# EAGLE design mrShark 07 (EAGLE 6.1)

## Sheet 1 of 2
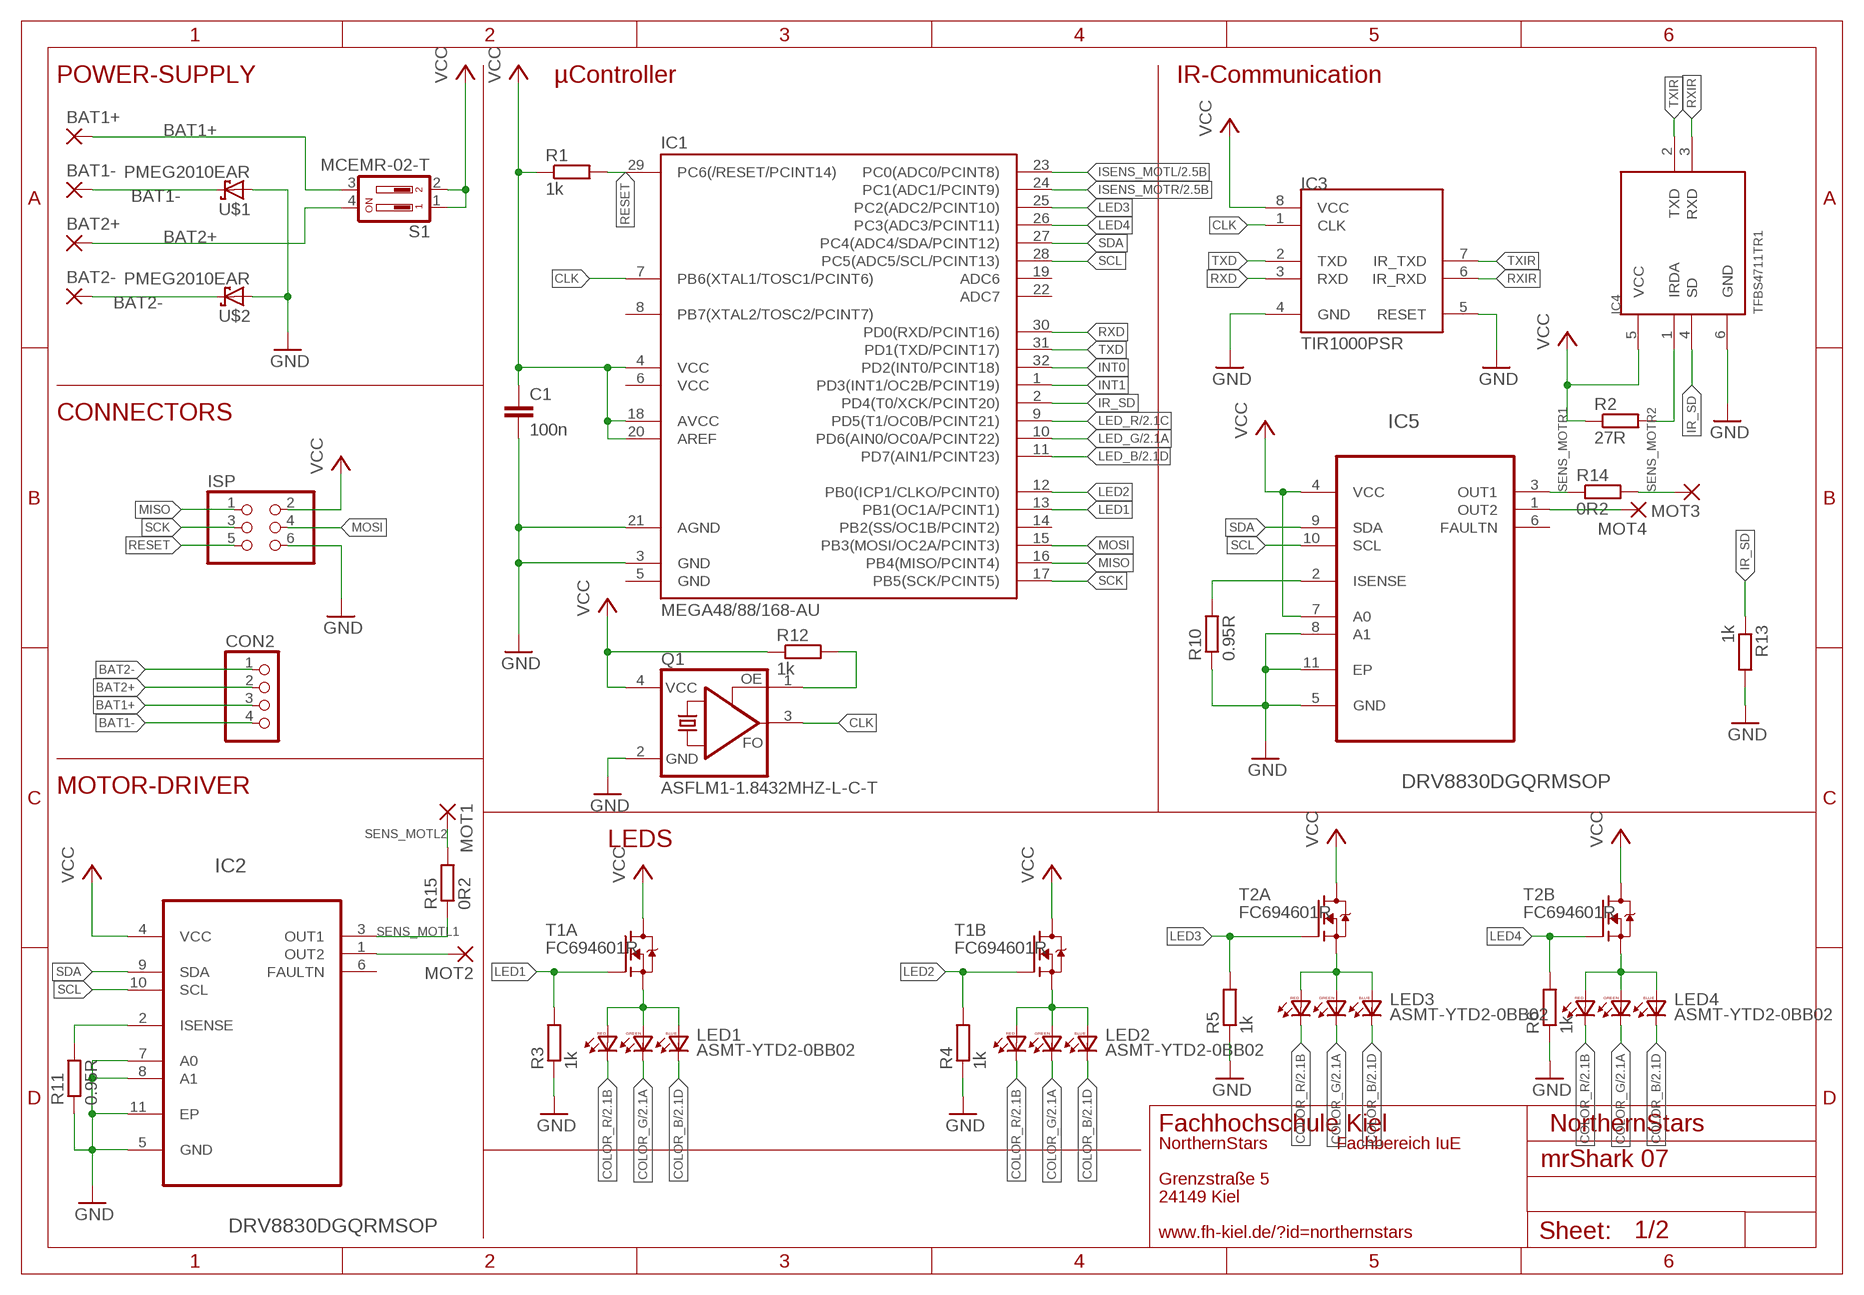
[diagram p0: schematic, sheet 1]

### Parts
BAT1+  1,6/0,9  [1,6/0,9]
BAT1-  1,6/0,9  [1,6/0,9]
BAT2+  1,6/0,9  [1,6/0,9]
BAT2-  1,6/0,9  [1,6/0,9]
C1  100n  C-EUC1206  [C1206]
CON2  PINHD-1X04_2.54-SMD-90°  [1X04SMD/90]
IC1  MEGA48/88/168-AU  [TQFP32-08]
IC2  DRV8830DGQRMSOP  [SOP65P640X110-15N]
IC3  TIR1000PSR  [SO-08]
IC4  TFBS4711TR1  [TFBS4711]
IC5  DRV8830DGQRMSOP  [SOP65P640X110-15N]
ISP  PINHD-2X03_2.54-SMD  [2X03SMD]
LED1  ASMT-YTD2-0BB02  PLCC6K  [PLCC6K]
LED2  ASMT-YTD2-0BB02  PLCC6K  [PLCC6K]
LED3  ASMT-YTD2-0BB02  PLCC6K  [PLCC6K]
LED4  ASMT-YTD2-0BB02  PLCC6K  [PLCC6K]
MOT1  1,6/0,9  [1,6/0,9]
MOT2  1,6/0,9  [1,6/0,9]
MOT3  1,6/0,9  [1,6/0,9]
MOT4  1,6/0,9  [1,6/0,9]
Q1  ASFLM1-1.8432MHZ-L-C-T  HC536R  [HC536]
R1  1k  R-EU_R1206  [R1206]
R2  27R  R-EU_R1206  [R1206]
R3  1k  R-EU_R1206  [R1206]
R4  1k  R-EU_R1206  [R1206]
R5  1k  R-EU_R1206  [R1206]
R6  1k  R-EU_R1206  [R1206]
R10  0.95R  R-EU_R1206  [R1206]
R11  0.95R  R-EU_R1206  [R1206]
R12  1k  R-EU_R1206  [R1206]
R13  1k  R-EU_R1206  [R1206]
R14  0R2  R-EU_R0805  [R0805]
R15  0R2  R-EU_R0805  [R0805]
S1  MCEMR-02-T  219-02  [CTS-219-02]
T1  FC694601R  [SOT-666]
T2  FC694601R  [SOT-666]
U$1  PMEG2010EAR  [SOD323-R]
U$2  PMEG2010EAR  [SOD323-R]

### Nets
BAT1+: BAT1+.1(P) CON2.3 S1.3
BAT1-: BAT1-.1(P) CON2.4 U$1.C
BAT2+: BAT2+.1(P) CON2.2 S1.4
BAT2-: BAT2-.1(P) CON2.1 U$2.C
CLK: IC1.7(PB6(XTAL1/TOSC1/PCINT6)) IC3.1(CLK) Q1.3(FO)
COLOR_B: LED1.1(BC) LED2.1(BC) LED3.1(BC) LED4.1(BC) ; also sheet 2
COLOR_G: LED1.2(GC) LED2.2(GC) LED3.2(GC) LED4.2(GC) ; also sheet 2
COLOR_R: LED1.3(RC) LED2.3(RC) LED3.3(RC) LED4.3(RC) ; also sheet 2
GND: C1.2 IC1.3(GND) IC1.21(AGND) IC2.5(GND) IC2.7(A0) IC2.8(A1) IC2.11(EP) IC3.4(GND) IC3.5(RESET) IC4.6(GND) IC5.5(GND) IC5.8(A1) IC5.11(EP) ISP.6 Q1.2(GND) R3.1 R4.1 R5.1 R6.1 R10.1 R11.1 R13.2 U$1.A U$2.A ; also sheet 2
INT0: IC1.32(PD2(INT0/PCINT18))
INT1: IC1.1(PD3(INT1/OC2B/PCINT19))
IR_SD: IC1.2(PD4(T0/XCK/PCINT20)) IC4.4(SD) R13.1
IRDA: IC4.1(IRDA) R2.2
ISENS_MOTL: IC1.23(PC0(ADC0/PCINT8)) ; also sheet 2
ISENS_MOTR: IC1.24(PC1(ADC1/PCINT9)) ; also sheet 2
LED1: IC1.13(PB1(OC1A/PCINT1)) R3.2 T1.2(A:G)
LED1+: LED1.4(RA) LED1.5(GA) LED1.6(BA) T1.1(A:S)
LED2: IC1.12(PB0(ICP1/CLKO/PCINT0)) R4.2 T1.5(B:G)
LED2+: LED2.4(RA) LED2.5(GA) LED2.6(BA) T1.4(B:S)
LED3: IC1.25(PC2(ADC2/PCINT10)) R5.2 T2.2(A:G)
LED3+: LED3.4(RA) LED3.5(GA) LED3.6(BA) T2.1(A:S)
LED4: IC1.26(PC3(ADC3/PCINT11)) R6.2 T2.5(B:G)
LED4+: LED4.4(RA) LED4.5(GA) LED4.6(BA) T2.4(B:S)
LED_B: IC1.11(PD7(AIN1/PCINT23)) ; also sheet 2
LED_G: IC1.10(PD6(AIN0/OC0A/PCINT22)) ; also sheet 2
LED_R: IC1.9(PD5(T1/OC0B/PCINT21)) ; also sheet 2
MISO: IC1.16(PB4(MISO/PCINT4)) ISP.1
MOSI: IC1.15(PB3(MOSI/OC2A/PCINT3)) ISP.4
N$3: IC5.1(OUT2) MOT4.1(P)
N$4: Q1.1(OE) R12.2
N$5: IC5.2(ISENSE) R10.2
N$7: IC2.2(ISENSE) R11.2
N$16: IC2.1(OUT2) MOT2.1(P)
RESET: IC1.29(PC6(/RESET/PCINT14)) ISP.5 R1.2
RXD: IC1.30(PD0(RXD/PCINT16)) IC3.3(RXD)
RXIR: IC3.6(IR_RXD) IC4.3(RXD)
SCK: IC1.17(PB5(SCK/PCINT5)) ISP.3
SCL: IC1.28(PC5(ADC5/SCL/PCINT13)) IC2.10(SCL) IC5.10(SCL)
SDA: IC1.27(PC4(ADC4/SDA/PCINT12)) IC2.9(SDA) IC5.9(SDA)
SENS_MOTL1: IC2.3(OUT1) R15.1 ; also sheet 2
SENS_MOTL2: MOT1.1(P) R15.2 ; also sheet 2
SENS_MOTR1: IC5.3(OUT1) R14.1 ; also sheet 2
SENS_MOTR2: MOT3.1(P) R14.2 ; also sheet 2
TXD: IC1.31(PD1(TXD/PCINT17)) IC3.2(TXD)
TXIR: IC3.7(IR_TXD) IC4.2(TXD)
VCC: C1.1 IC1.4(VCC) IC1.18(AVCC) IC1.20(AREF) IC2.4(VCC) IC3.8(VCC) IC4.5(VCC) IC5.4(VCC) IC5.7(A0) ISP.2 Q1.4(VCC) R1.1 R2.1 R12.1 S1.1 S1.2 T1.3(B:D) T1.6(A:D) T2.3(B:D) T2.6(A:D) ; also sheet 2
Unconnected: IC1.8(PB7(XTAL2/TOSC2/PCINT7)) IC1.14(PB2(SS/OC1B/PCINT2)) IC1.19(ADC6) IC1.22(ADC7) IC2.6(FAULTN) IC5.6(FAULTN)

### Notes on the sheet
- POWER-SUPPLY | µController | IR-Communication
- CONNECTORS
- MOTOR-DRIVER
- LEDS
- Fachhochschule Kiel | NorthernStars
- NorthernStars | Fachbereich IuE
- Grenzstraße 5
- 24149 Kiel
- www.fh-kiel.de/?id=northernstars

## Sheet 2 of 2
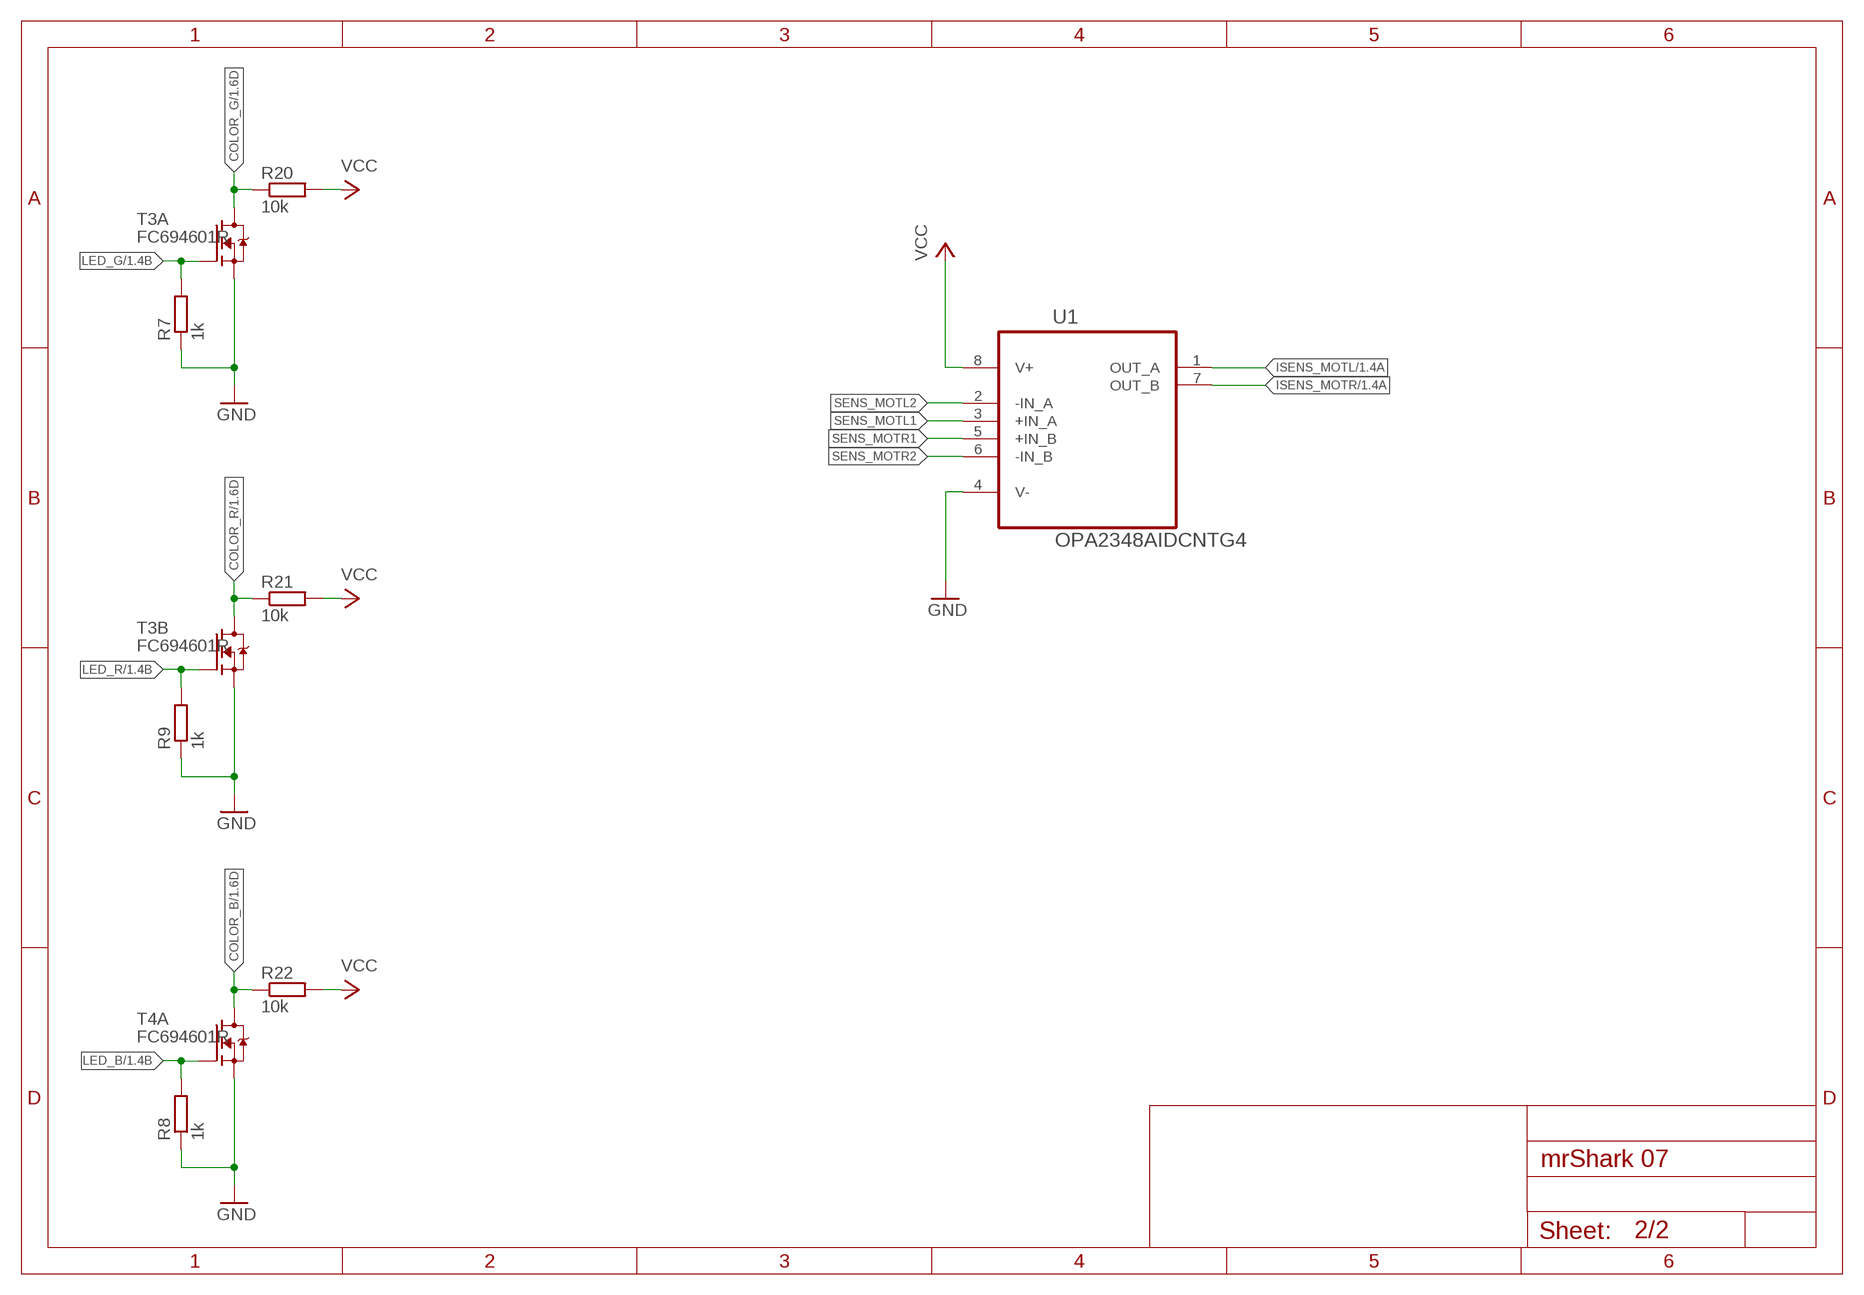
[diagram p1: schematic, sheet 2]

### Parts
R7  1k  R-EU_R1206  [R1206]
R8  1k  R-EU_R1206  [R1206]
R9  1k  R-EU_R1206  [R1206]
R20  10k  R-EU_M0805  [M0805]
R21  10k  R-EU_M0805  [M0805]
R22  10k  R-EU_M0805  [M0805]
T3  FC694601R  [SOT-666]
T4  FC694601R  [SOT-666]
U1  OPA2348AIDCNTG4  [SOT65P280X145-8N]

### Nets
COLOR_B: R22.1 T4.6(A:D) ; also sheet 1
COLOR_G: R20.1 T3.6(A:D) ; also sheet 1
COLOR_R: R21.1 T3.3(B:D) ; also sheet 1
GND: R7.1 R8.1 R9.1 T3.1(A:S) T3.4(B:S) T4.1(A:S) U1.4(V-) ; also sheet 1
ISENS_MOTL: U1.1(OUT_A) ; also sheet 1
ISENS_MOTR: U1.7(OUT_B) ; also sheet 1
LED_B: R8.2 T4.2(A:G) ; also sheet 1
LED_G: R7.2 T3.2(A:G) ; also sheet 1
LED_R: R9.2 T3.5(B:G) ; also sheet 1
SENS_MOTL1: U1.3(+IN_A) ; also sheet 1
SENS_MOTL2: U1.2(-IN_A) ; also sheet 1
SENS_MOTR1: U1.5(+IN_B) ; also sheet 1
SENS_MOTR2: U1.6(-IN_B) ; also sheet 1
VCC: R20.2 R21.2 R22.2 U1.8(V+) ; also sheet 1
Unconnected: T4.3(B:D) T4.4(B:S) T4.5(B:G)

## Power pins joined to a net without a drawn wire
GND: IC1.5(GND)
VCC: IC1.6(VCC)

## Library data of the parts
BAT1+ BAT1- BAT2+ BAT2- MOT1-MOT4 = wirepad:1,6/0,9: THROUGH-HOLE PAD
C1 = rcl:C-EU: CAPACITOR, European symbol
CON2 = pinhead-2:PINHD-1X04: PIN HEADER
IC1 = avr-6:MEGA48/88/168
IC2 IC5 = texas:DRV8830DGQR: LOW-VOLTAGE MOTOR DRIVER WITH SERIAL INTERFACE; MPN: DRV8830DGQR; OC_FARNELL: 1863106; OC_NEWARK: 58T1482; PACKAGE: MSOP-10; SUPPLIER: TEXAS INSTRUMENTS
IC3 = texas:TIR1000: Texas Instruments TIR1000 STANDALONE IrDATM ENCODER AND DECODER
IC4 = vishay:TFBS4711: TRANSCEIVER IRDA Vishay TFBS4711-TR1 Infrared Transciever 900nm, 600µA, 1m range
ISP = pinhead-2:PINHD-2X03: PIN HEADER
LED1-LED4 = led:PLCC6: Standart PLCC6 Package RGB LED
Q1 = crystal:HC536: Crystal HC536R For example: Fox Electronics FOX-HC536R
R1-R15 R20-R22 = rcl:R-EU_: RESISTOR, European symbol
S1 = switch-dil:219-02*: Surface Mount DIP Switch Series 219 SMT CTS Electronic Components Sourc: www.ctscorp.com
T1-T4 = panasonic:FC694601R: FC6946010R Dual N-channel MOSFET
U1 = texas:OPA2348AIDCNTG4: OPERATIONAL AMPLIFIERS; MPN: OPA2348AIDCNTG4; OC_FARNELL: 1207098; OC_NEWARK: 97K6805; PACKAGE: SOT23-8; SUPPLIER: Texas Instruments
U$1 U$2 = diode:PMEG2010EA: NXP - Low V F (MEGA) Schottky barrier diode If = 1A, Vr = 20V http://www.farnell.com/datasheets/687996.pdf

## Board
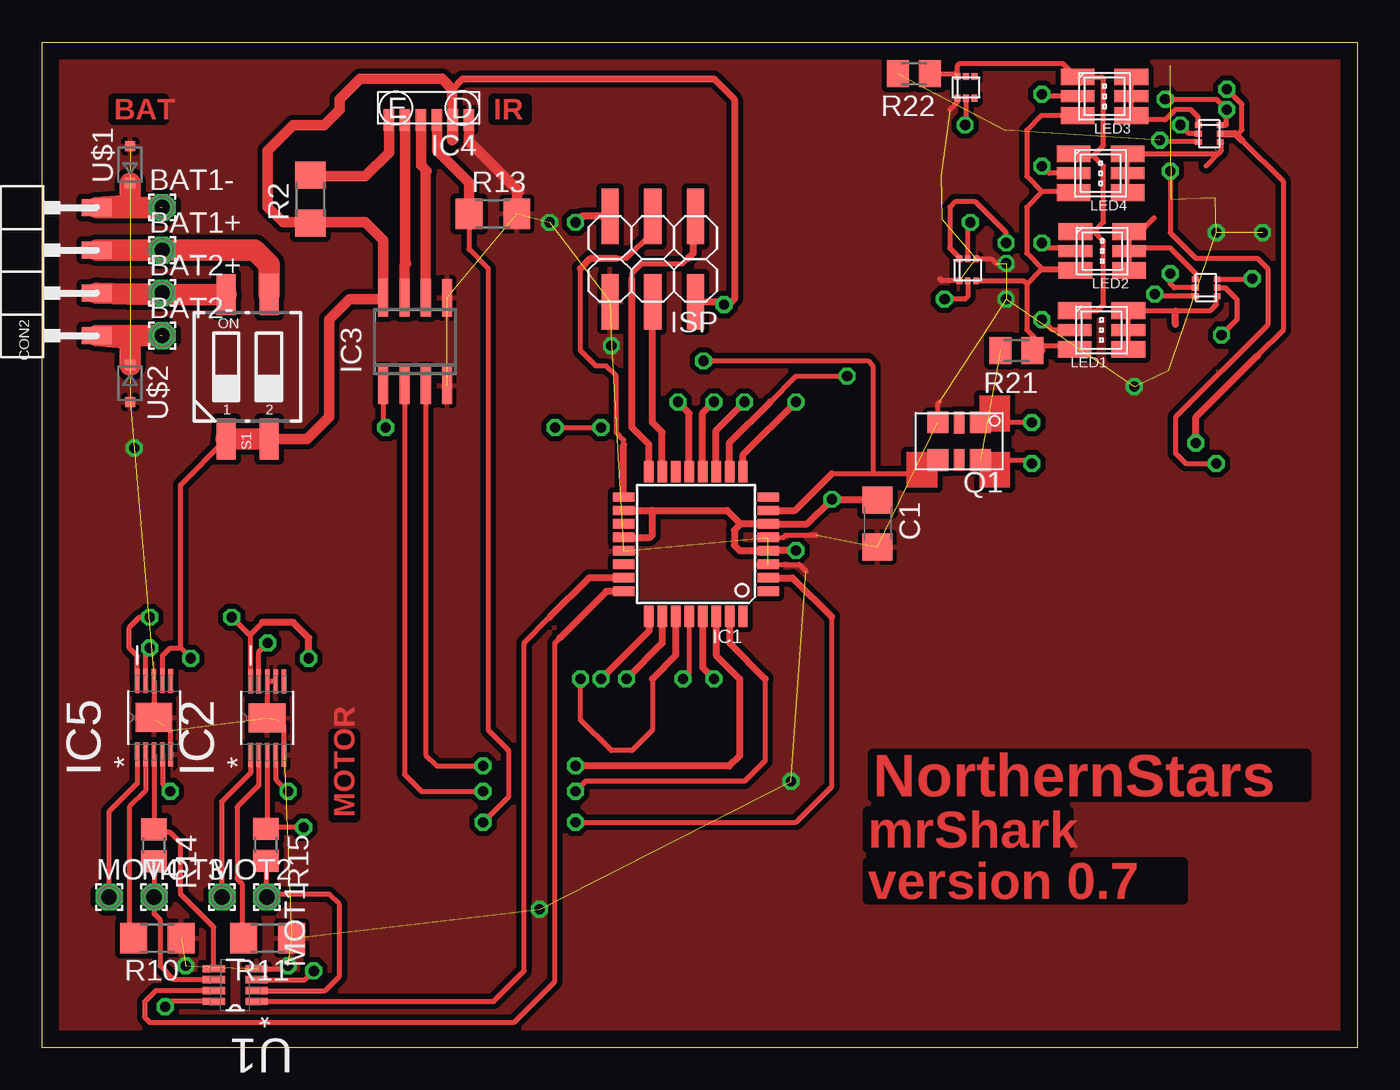
[diagram p2: board, top side]
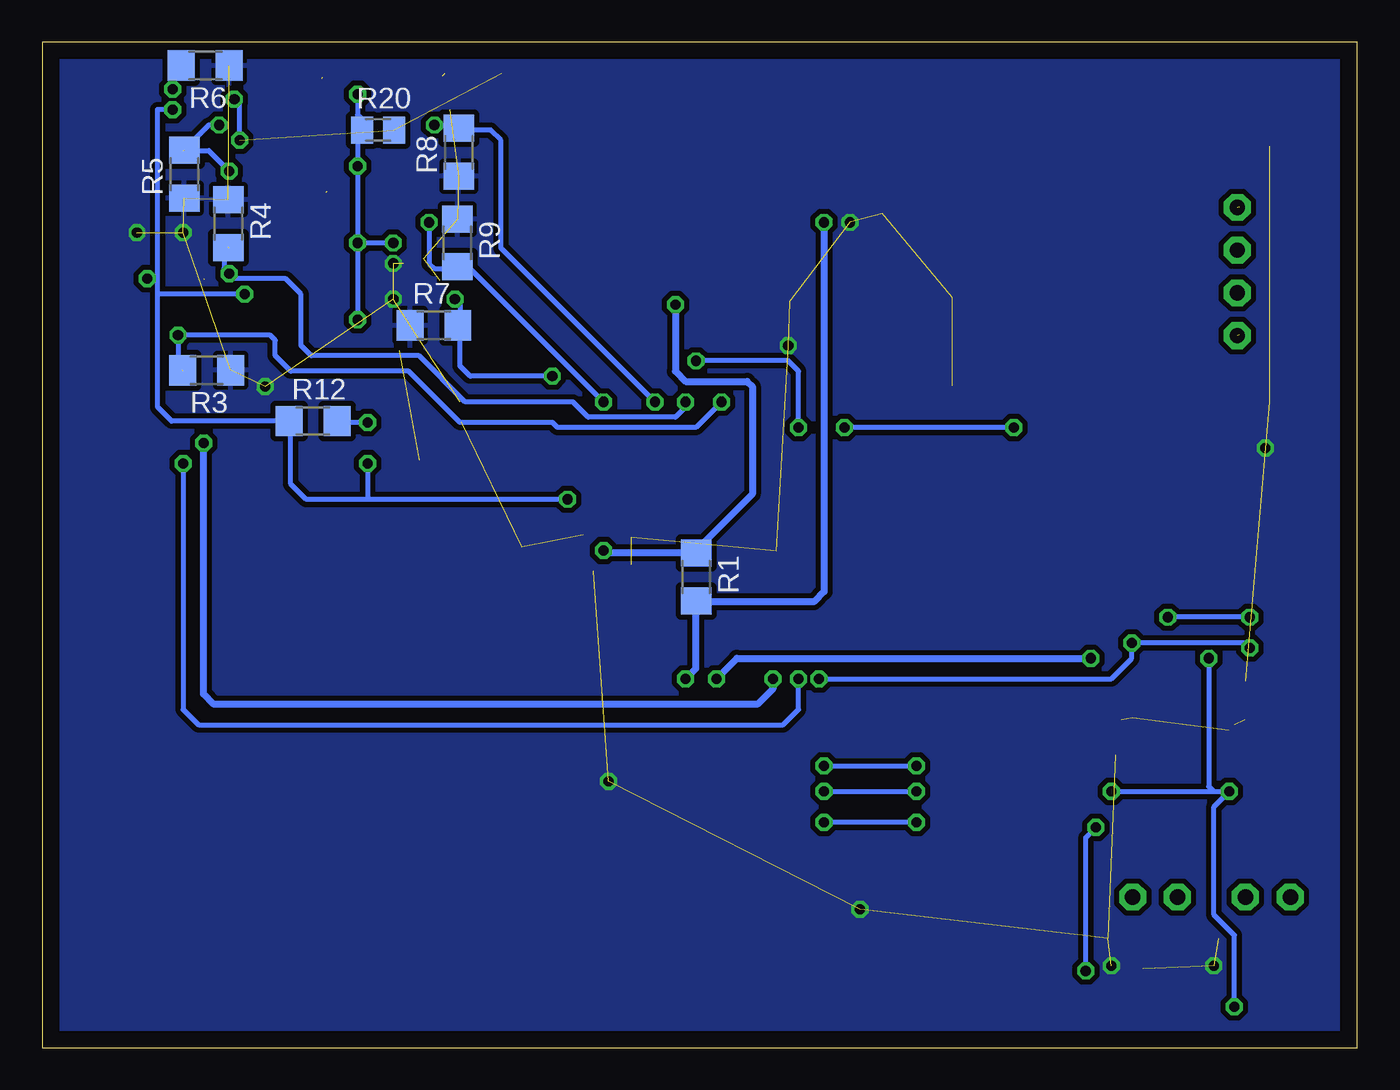
[diagram p3: board, bottom side, seen from below]

Size 78.18 x 59.79 mm. Coordinates in mm from the lower left corner, seen from the top.
Outline: 0,0 0,59.79 78.18,59.79 78.18,0 0,0
Copper layers (1*16): Top 0.035mm / dielectric 1.5mm / Bottom 0.035mm
Design rules: minimum track width 10mil, minimum drill 24mil, track to track 8mil, track to pad 8mil, pad to pad 8mil, via to via 8mil, smd to smd 8mil, copper to edge 40mil, drill to drill 8mil, minimum pad ring 10mil, minimum via ring 8mil, stop-mask expansion 4mil, vias tented up to drill 0mil, thermal gap 10mil
tRestrict: area 52.1,34.4 to 57.3,37.5; area 54.3,56.7 to 55.5,57.6; area 54.3,45.7 to 55.8,46.6

### Footprints (pad centres in the part's own frame; a part is rotated, then mirrored left to right if it is on the bottom)
1,6/0,9 = drill 0.914 pad 1.6 octagon: 1 0,0
C1206 = smd 1.6 x 1.8: 1 -1.4,0; 2 1.4,0
1X04SMD/90 = smd 1.016 x 1.778: 1 -1.27,-5.08; 2 1.27,-5.08; 3 3.81,-5.08; 4 6.35,-5.08
TQFP32-08 = smd 1.27 x 0.559: 1 -4.293,2.8; 2 -4.293,2; 3 -4.293,1.2; 4 -4.293,0.4; 5 -4.293,-0.4; 6 -4.293,-1.2; 7 -4.293,-2; 8 -4.293,-2.8; 17 4.293,-2.8; 18 4.293,-2; 19 4.293,-1.2; 20 4.293,-0.4; 21 4.293,0.4; 22 4.293,1.2; 23 4.293,2; 24 4.293,2.8 | smd 0.559 x 1.27: 9 -2.8,-4.293; 10 -2,-4.293; 11 -1.2,-4.293; 12 -0.4,-4.293; 13 0.4,-4.293; 14 1.2,-4.293; 15 2,-4.293; 16 2.8,-4.293; 25 2.8,4.293; 26 2,4.293; 27 1.2,4.293; 28 0.4,4.293; 29 -0.4,4.293; 30 -1.2,4.293; 31 -2,4.293; 32 -2.8,4.293
SOP65P640X110-15N = smd 1.422 x 0.279: 1 -2.184,0.991; 2 -2.184,0.508; 3 -2.184,0; 4 -2.184,-0.508; 5 -2.184,-0.991; 6 2.184,-0.991; 7 2.184,-0.508; 8 2.184,0; 9 2.184,0.508; 10 2.184,0.991 | smd 1.727 x 2.184: 11 0,0
SO-08 = smd 0.6 x 2.2: 1 -1.905,-2.6; 2 -0.635,-2.6; 3 0.635,-2.6; 4 1.905,-2.6; 5 1.905,2.6; 6 0.635,2.6; 7 -0.635,2.6; 8 -1.905,2.6
TFBS4711 = smd 0.635 x 1.27: 1 2.37,0.72; 2 1.42,0.72; 3 0.47,0.72; 4 -0.48,0.72; 5 -1.43,0.72; 6 -2.38,0.72
2X03SMD = smd 1.016 x 3.302: 1 -1.27,-3.81; 2 -1.27,1.27; 3 1.27,-3.81; 4 1.27,1.27; 5 3.81,-3.81; 6 3.81,1.27
PLCC6K = smd 2 x 1: 1 1.6,-1.15; 3 1.6,1.15; 4 -1.6,1.15; 6 -1.6,-1.15 | smd 2 x 0.7: 2 1.6,0; 5 -1.6,0
HC536 = smd 1.24 x 1.29: 1 -1.27,-1.125; 2 1.27,-1.125; 3 1.27,1.125; 4 -1.27,1.125 | smd 0.64 x 1.29: TP1 0,1.1; TP2 0,-1.1
R1206 = smd 1.6 x 1.803: 1 -1.422,0; 2 1.422,0
R0805 = smd 1.3 x 1.5: 1 -0.95,0; 2 0.95,0
M0805 = smd 1.3 x 1.6: 1 -0.95,0; 2 0.95,0
CTS-219-02 = smd 1.13 x 2.44: 1 -1.27,-4.3; 2 1.27,-4.3; 3 1.27,4.3; 4 -1.27,4.3
SOT-666 = smd 0.35 x 0.4: 1 -0.5,-0.65; 2 0,-0.65; 3 0.5,-0.65; 4 0.5,0.65; 5 0,0.65; 6 -0.5,0.65
SOT65P280X145-8N = smd 1.321 x 0.432: 1 -1.27,0.965; 2 -1.27,0.33; 3 -1.27,-0.33; 4 -1.27,-0.965; 5 1.27,-0.965; 6 1.27,-0.33; 7 1.27,0.33; 8 1.27,0.965
SOD323-R = smd 0.6 x 0.6: A 1.1,0; C -1.1,0

### Placement (x,y rotation side)
BAT1+  7.14,47.42 0 top
BAT1-  7.14,49.96 0 top
BAT2+  7.14,44.88 0 top
BAT2-  7.14,42.34 0 top
C1  49.66,31.17 270 top
CON2  -1.83,43.6 90 top
IC1  38.86,29.95 180 top
IC2  13.39,19.61 90 top
IC3  22.17,41.99 0 top
IC4  22.99,55.88 180 top
IC5  6.65,19.63 90 top
ISP  37.57,45.62 180 top
LED1  62.97,42.67 180 top
LED2  63.02,47.37 180 top
LED3  63.14,56.57 180 top
LED4  62.92,51.99 180 top
MOT1  13.36,8.97 270 top
MOT2  10.69,8.97 0 top
MOT3  6.65,8.97 0 top
MOT4  3.99,8.97 0 top
Q1  54.51,36.07 180 top
R1  39.29,27.99 270 bottom
R2  15.95,50.44 90 top
R3  68.4,40.28 180 bottom
R4  67.11,49 270 bottom
R5  69.72,51.94 90 bottom
R6  68.48,58.39 180 bottom
R7  54.89,42.95 0 bottom
R8  53.42,53.24 90 bottom
R9  53.49,47.85 270 bottom
R10  6.86,6.53 180 top
R11  13.41,6.53 180 top
R12  62.08,37.26 0 bottom
R13  26.8,49.58 0 top
R14  6.65,12.04 270 top
R15  13.31,12.06 270 top
R20  58.22,54.56 0 bottom
R21  57.91,41.45 180 top
R22  51.82,57.91 180 top
S1  12.22,40.49 0 top
T1  69.19,45.19 90 top
T2  69.37,54.36 270 top
T3  55.02,46.25 0 top
T4  54.91,57.1 0 top
U1  11.48,3.73 180 top
U$1  5.23,52.5 90 top
U$2  5.23,39.5 270 top

### Tracks (layer width: path | path; a pad name or v marks a point on that pad's centre or on a via)
BAT1+
  Top 1.27: S1.3 13.49,46.56 12.62,47.42 BAT1+.1 7.13,47.41 CON2.3
BAT1-  (1 unrouted)
  Top 1.27: 7.01,49.99 6.98,49.95 CON2.4 5.23,50.11 U$1.C
BAT2+
  Top 1.27: S1.4 7.23,44.79 BAT2+.1 7.24,44.88 7.32,44.81 5.14,44.81 CON2.2
BAT2-  (1 unrouted)
  Top 1.27: 7.01,42.37 6.98,42.33 CON2.1 5.23,42.18 U$2.C
CLK  (via drill 0.6)
  Top 0.305: 46.94,34.14 49.38,34.14 | 49.38,34.14 52.43,34.14 Q1.3 | IC3.1 20.27,37.03 v20.42,36.88 | v39.32,40.84 49.07,40.84 49.38,40.54 49.38,34.14 | v30.48,36.88 v33.22,36.88
  Top 0.406: IC1.7 44.75,31.95 46.94,34.14
  Bottom 0.305: v20.42,36.88 v30.48,36.88 | v33.22,36.88 33.22,40.23 33.83,40.84 v39.32,40.84
COLOR_B  (2 unrouted)
  Top 0.305: LED3.1 62.98,57.72 63.09,57.61 63.09,53.65 62.48,53.03 | LED4.1 61.42,53.03 62.48,53.03 | LED2.1 62.54,48.52 | 62.54,48.52 63.09,49.07 63.09,52.43 62.48,53.03 | LED1.1 62.72,43.82 63.09,44.2 63.09,47.97 62.54,48.52 | T4.6 54.41,58.38 54.56,58.52 60.66,58.52 61.57,57.61 | R22.1 54.25,57.91
COLOR_G  (via drill 0.6)
  Top 0.305: LED4.2 59.87,51.99 v59.44,52.43 | LED2.2 61.24,47.55 59.74,47.55 v59.44,47.85 | LED1.2 60.05,42.67 v59.44,43.28 | LED3.2 59.56,56.57 v59.44,56.69 | T3.6 54.52,46.98 53.95,47.55 53.95,49.99 54.25,50.29 55.47,50.29 57.3,48.46 v57.3,47.85
  Bottom 0.305: v59.44,47.85 v59.44,52.43 59.44,55.47 | v59.44,47.85 v59.44,43.28 | v59.44,56.69 59.44,55.47 | v57.3,47.85 v59.44,47.85 | R20.1 59.17,55.2 59.44,55.47
COLOR_R  (1 unrouted)
  Top 0.305: LED3.3 59.38,55.42 58.52,54.56 58.52,51.82 59.44,50.9 | 61.27,50.9 59.44,50.9 | 59.44,50.9 58.52,49.99 58.52,47.24 59.44,46.33 61.31,46.33 LED2.3 59.33,46.22 58.52,45.41 | 58.52,45.41 58.52,42.67 59.44,41.76 61.13,41.76 LED1.3 | T3.3 58.33,45.6 58.52,45.41
  Top 0.406: R21.1 59.44,41.45 59.44,41.76
GND  (via drill 0.6)  (38 unrouted)
  Top 0.305: IC2.11 IC2.8 IC2.7 | IC2.5 14.38,19.15 14.02,19.51 | IC5.5 7.64,18.87 7.32,19.2 | IC5.8 IC5.11 6.66,19.56 6.71,19.51 | T3.4 56.42,46.9 56.69,46.63 | U1.4 14.45,4.7 v14.63,4.88 | IC1.3 45.02,28.75 45.41,28.35 | IC1.5 44.06,30.35 44.2,30.48 46.02,30.48 | Q1.2 53.24,38.3 53.34,38.41 | T4.1 54.41,56.24 53.95,55.78 | T3.1 53.46,45.6 53.34,45.72
  Top 0.61: IC4.6 25.37,53.88 28.35,50.9 28.22,50.77 R13.2
  other vias: 33.83,41.76 57.3,46.63 69.8,48.46 72.54,48.46 64.92,39.32 57.3,44.5 30.18,49.07 5.49,35.66 8.53,4.88 44.5,15.85 29.57,8.23
  pour Top (isolate 0.305): 0,0 0,59.69 78.74,59.69 78.74,0
  pour Bottom (isolate 0.305): 0,0 0,59.69 78.74,59.69 78.74,0
IR_SD  (via drill 0.6)
  Top 0.305: R13.1 25.38,47.47 26.52,46.33 26.52,18.9 27.74,17.68 27.74,14.94 v26.21,13.41 | v31.7,13.41 44.81,13.41 46.94,15.54 46.94,25.6
  Top 0.406: IC1.2 44.6,27.95 46.94,25.6
  Top 0.61: IC4.4 23.47,53.34 25.38,51.44 R13.1
  Bottom 0.305: v26.21,13.41 v31.7,13.41
IRDA
  Top 0.61: IC4.1 20.62,53.23 19.2,51.82 16,51.82 R2.2
ISENS_MOTL
  Top 0.305: U1.1 26.85,2.77 28.65,4.57 28.65,24.08 30.18,25.6
  Top 0.406: IC1.23 32.52,27.95 30.18,25.6
ISENS_MOTR
  Top 0.305: U1.7 6.76,3.4 6.1,2.74 6.1,1.83 6.4,1.52 28.04,1.52 30.48,3.96 30.48,24.08 30.79,24.38
  Top 0.406: IC1.24 33.55,27.15 30.79,24.38
LED1  (via drill 0.6)  (1 unrouted)
  Top 0.305: T1.2 70.33,45.19 71.02,44.5 71.02,43.28 v70.1,42.37
  Top 0.406: IC1.13 38.46,37.74 v37.8,38.41
  Bottom 0.305: 69.8,40.23 70.1,40.54 v70.1,42.37 64.62,42.37 64.31,42.06 64.31,41.15 63.4,40.23 56.39,40.23 53.34,37.19 47.85,37.19 47.55,36.88 39.32,36.88 v37.8,38.41
LED1+
  Top 0.305: LED1.4 LED1.5 LED1.6 67.36,43.82 69.42,43.82 69.8,44.2 69.8,44.65 T1.1
  Top 0.406: 67.36,43.01 67.36,43.82
LED2  (via drill 0.6)  (1 unrouted)
  Top 0.305: v67.06,46.02 67.06,45.41 67.28,45.19 T1.5
  Top 0.406: IC1.12 39.26,37.74 v39.93,38.41
  Bottom 0.305: 67.06,47.55 67.36,47.24 67.36,46.33 v67.06,46.02 67.06,45.72 63.7,45.72 62.79,44.81 62.79,41.76 62.18,41.15 55.78,41.15 53.03,38.41 46.63,38.41 45.72,37.49 40.54,37.49 39.93,38.1 v39.93,38.41
LED2+  (1 unrouted)
  Top 0.305: LED2.4 LED2.5 | LED2.5 LED2.6 64.62,48.46 64.92,48.16 66.11,49.34 | 68.58,45.72 68.58,46.02 67.06,47.55 64.8,47.55 LED2.5
LED3  (via drill 0.6)  (1 unrouted)
  Top 0.305: T2.2 68.17,54.36 v67.67,54.86 | v67.06,52.12 67.06,48.46 68.58,46.94 72.24,46.94 72.85,46.33 72.85,42.98 67.36,37.49 67.36,35.36 67.97,34.75 v69.8,34.75
  Top 0.406: IC1.25 36.06,24.78 v33.22,21.95
  Bottom 0.305: v67.67,54.86 68.28,54.86 69.8,53.34 68.28,53.34 v67.06,52.12 | v69.8,34.75 69.8,20.12 68.89,19.2 34.14,19.2 33.22,20.12 v33.22,21.95
LED3+
  Top 0.305: LED3.6 LED3.5 LED3.4 64.8,55.47 64.92,55.47 65.23,55.17 66.75,55.17 67.36,55.78 68.28,55.78 68.72,55.34 T2.1
LED4  (via drill 0.6)
  Top 0.305: T2.5 71.12,54.36 71.32,54.56 71.32,56.08 v70.41,57 | 71.32,53.95 73.76,51.51 73.76,42.67 72.24,41.15
  Top 0.406: IC1.26 36.86,24.06 v34.75,21.95 | T2.5 70.92,54.36 71.32,53.95 | v68.58,35.97 68.58,37.49 72.24,41.15
  Bottom 0.305: v70.41,57 70.41,57.89 R6.2
  Bottom 0.406: v34.75,21.95 34.75,21.34 35.66,20.42 67.97,20.42 68.58,21.03 v68.58,35.97
LED4+
  Top 0.305: LED4.4 LED4.5 | LED4.5 64.52,52.02 64.62,52.12 | LED4.5 LED4.6 69.91,53.14 | 69.91,53.14 70.1,53.34 70.1,53.77 T2.4 | 69.19,52.43 69.91,53.14
LED_B  (via drill 0.6)
  Top 0.305: T4.2 54.91,54.91 v54.86,54.86
  Top 0.406: IC1.11 40.06,36.71 v41.76,38.41
  Bottom 0.305: v54.86,54.86 53.65,54.86 53.34,54.56 53.31,54.56 | v41.76,38.41 50.9,47.55 50.9,53.95 51.51,54.56 53.31,54.56 | 53.31,54.56 R8.2
LED_G  (via drill 0.6)
  Top 0.305: 43.28,38.41 44.81,39.93 v47.85,39.93 | T3.2 55.02,44.65 54.86,44.5 v53.65,44.5
  Top 0.406: IC1.10 40.86,35.98 43.28,38.41
  Bottom 0.305: v53.65,44.5 53.34,44.2 53.34,43.08 R7.2 53.34,42.82 53.34,40.54 52.73,39.93 v47.85,39.93
LED_R  (via drill 0.6)
  Top 0.305: T3.5 55.02,48.92 v55.17,49.07
  Top 0.406: IC1.9 41.66,35.26 v44.81,38.41
  Bottom 0.305: v55.17,49.07 55.17,46.63 54.86,46.33 53.65,46.33 | 53.65,46.33 52.73,46.33 v44.81,38.41 | R9.2 53.54,46.43 53.65,46.33
MISO
  Top 0.305: 35.05,45.72 35.05,46.02 35.66,46.63 38.1,46.63 38.41,46.94
  Top 0.406: IC1.16 36.06,35.87 35.05,36.88 35.05,45.72 | 38.41,46.94 38.71,47.24 38.71,49.3 ISP.1
MOSI
  Top 0.406: IC1.15 36.86,36.59 36.27,37.19 36.27,44.32 ISP.4
N$3
  Top 0.305: IC5.1 5.66,15.72 3.96,14.02 3.96,8.99 MOT4.1
N$4  (via drill 0.6)
  Top 0.305: Q1.1 v58.82,37.19 v58.83,37.19
  Bottom 0.305: v58.83,37.19 60.66,37.19 R12.2
N$5
  Top 0.305: IC5.2 6.15,15.29 5.18,14.33 5.18,6.78 R10.2
N$7
  Top 0.305: IC2.2 12.88,15.62 11.58,14.33 11.58,10.06 11.89,9.75 11.89,6.63 R11.2
N$16
  Top 0.305: IC2.1 12.39,16.36 10.67,14.63 10.67,9.14 10.69,9.12 MOT2.1
RESET  (via drill 0.6)
  Top 0.406: IC1.29 39.26,22.61 v39.93,21.95 | ISP.5 32.05,49.43 v31.7,49.07
  Bottom 0.406: v39.93,21.95 39.32,22.55 39.32,26.54 R1.2 39.24,26.52 32.31,26.52 31.7,27.13 v31.7,49.07
RXD  (via drill 0.6)
  Top 0.305: IC3.3 22.81,17.42 23.47,16.76 v26.21,16.76
  Top 0.406: IC1.30 40.06,23.34 41.45,21.95 41.45,17.37 40.84,16.76 v31.7,16.76
  Bottom 0.305: v31.7,16.76 v26.21,16.76
RXIR
  Top 0.61: IC4.3 22.52,52.46 22.86,52.12 22.81,52.07 IC3.6
SCK
  Top 0.305: 34.14,46.94 34.75,46.94 36.27,48.46 36.27,49.38 | 36.27,49.68 36.27,49.38 | ISP.3 36.3,49.4 36.27,49.38 | 34.57,35.84 34.57,36.14 34.14,36.58 34.14,39.93 33.53,40.54 32.92,40.54 32,41.45 32,46.33
  Top 0.406: IC1.17 34.57,35.84 | 32,46.33 32.61,46.94 34.14,46.94
SCL  (via drill 0.6)
  Top 0.305: IC5.10 5.66,23.29 5.18,23.77 5.18,24.99 5.79,25.6 v6.4,25.6 | IC2.10 12.39,24.49 | 12.39,24.49 v11.28,25.6 | 12.39,24.49 12.39,24.59 13.11,25.3 | 38.41,22.25 v38.1,21.95 38.46,22.31 IC1.28
  Top 0.406: v15.85,23.16 15.85,24.38 14.94,25.3 13.11,25.3
  Bottom 0.305: v6.4,25.6 v11.28,25.6
  Bottom 0.406: v15.85,23.16 36.88,23.16 v38.1,21.95
SDA  (via drill 0.6)
  Top 0.305: IC5.9 6.15,23.52 v6.4,23.77 | IC2.9 12.88,23.55 v13.41,24.08 | 36.27,21.95 36.27,18.9 35.05,17.68 33.83,17.68 32,19.51 v32,21.95
  Top 0.406: IC1.27 37.66,23.34 36.27,21.95
  Bottom 0.305: v6.4,23.77 6.71,24.08 v13.41,24.08 13.41,23.16 14.63,21.95 v32,21.95
SENS_MOTL1  (via drill 0.6)
  Top 0.305: IC2.3 13.39,13.09 R15.1 13.41,13.11 13.41,12.8 13.72,13.11 v15.54,13.11 | U1.3 15.65,4.06 v16.15,4.57
  Bottom 0.305: v16.15,4.57 16.15,12.5 v15.54,13.11
SENS_MOTL2
  Top 0.305: R15.2 13.31,9.02 MOT1.1 13.41,8.91 13.41,8.84 13.72,9.14 17.07,9.14 17.68,8.53 17.68,4.27 16.82,3.4 U1.2
SENS_MOTR1
  Top 0.305: IC5.3 R14.1 6.71,13.04 6.71,13.11 7.01,12.8 7.62,12.8 8.23,12.19 8.23,9.14 10.21,7.16 U1.5
SENS_MOTR2
  Top 0.305: R14.2 MOT3.1 6.66,7.98 7.01,7.62 7.01,4.88 7.82,4.06 U1.6
TXD  (via drill 0.6)
  Top 0.305: 42.98,21.95 42.98,17.07 41.76,15.85 32.31,15.85 v31.7,15.24 | IC3.2 21.54,16.26 22.55,15.24 v26.21,15.24
  Top 0.406: IC1.31 40.86,24.06 42.98,21.95
  Bottom 0.305: v31.7,15.24 v26.21,15.24
TXIR
  Top 0.61: IC4.2 21.57,46.71 21.64,46.63 21.54,46.53 IC3.7
VCC  (via drill 0.6)  (3 unrouted)
  Top 0.305: T2.6 70.4,54.86 v70.4,55.77 v70.41,55.78 69.8,56.39 v66.75,56.39 | T1.6 66.26,44.69 v66.14,44.81 | T2.3 66.54,53.86 v66.45,53.95 | Q1.4 58.63,34.94 v58.83,34.75 | U1.8 7.64,2.77 v7.32,2.44 | 7.32,15.54 v7.62,15.24 7.16,15.7 IC5.4 | IC2.4 13.89,15.98 v14.63,15.24 | IC5.7 7.16,23.32 7.62,23.77 8.23,23.77 | 8.23,23.77 v8.84,23.16 | 8.23,23.77 8.23,33.47 S1.1 | T1.3 71.9,45.69 v71.93,45.72
  Top 0.406: 41.51,31.15 IC1.6 45.47,31.15 v46.94,32.61 49.61,32.61 C1.1 | 41.51,31.15 41.15,30.79 41.15,29.87 41.47,29.55 IC1.4 43.17,29.57 v44.81,29.57 | IC1.18 36.27,31.95 | 36.27,31.95 40.71,31.95 41.51,31.15 | IC1.20 36.14,30.35 36.27,30.48 36.27,31.95 | ISP.2 40.39,44.35 v40.54,44.2 40.84,44.2 41.15,44.5 41.15,56.39 39.93,57.61 24.99,57.61 24.42,57.03 24.42,53.98
  Top 0.61: IC4.5 24.42,53.98 24.38,53.95 24.38,57 23.77,57.61 18.9,57.61 17.68,56.39 17.68,55.78 16.76,54.86 14.94,54.86 13.41,53.34 13.41,49.99 14.33,49.07 16.15,49.07 | 16.15,49.07 16.15,48.77 | 16.46,49.07 19.2,49.07 20.27,48.01 IC3.8 20.18,44.5 18.29,44.5 17.07,43.28 17.07,37.49 15.77,36.19 S1.2 | R2.1 16.41,49.02 16.46,49.07 | 16.46,49.07 16.15,49.07
  Top 1.27: S1.1 S1.2
  Bottom 0.305: v66.14,44.81 71.32,44.81 | 71.32,44.81 71.32,45.72 | 71.32,45.72 71.32,55.78 v70.41,55.78 | v66.45,53.95 66.45,56.08 v66.75,56.39 | 71.32,44.81 71.32,38.1 70.48,37.26 R12.1 63.4,37.16 63.4,33.53 62.48,32.61 58.83,32.61 | v46.94,32.61 58.83,32.61 | v58.83,34.75 58.83,32.61 | v14.63,15.24 8.53,15.24 | 8.53,15.24 v7.62,15.24 8.53,14.33 8.53,7.92 7.32,6.71 v7.32,2.44 | v8.84,23.16 8.84,15.54 8.53,15.24 | v71.93,45.72 71.32,45.72
  Bottom 0.406: v44.81,29.57 44.65,29.41 R1.1 39.29,29.54 39.32,29.57 35.97,32.92 35.97,39.32 36.27,39.62 39.93,39.62 40.54,40.23 v40.54,44.2
(copper drawn outside any net)
  shapes: Top area x3

### Text on the board
Top: BAT | IR | NorthernStars | MOTOR | mrShark | version 0.7